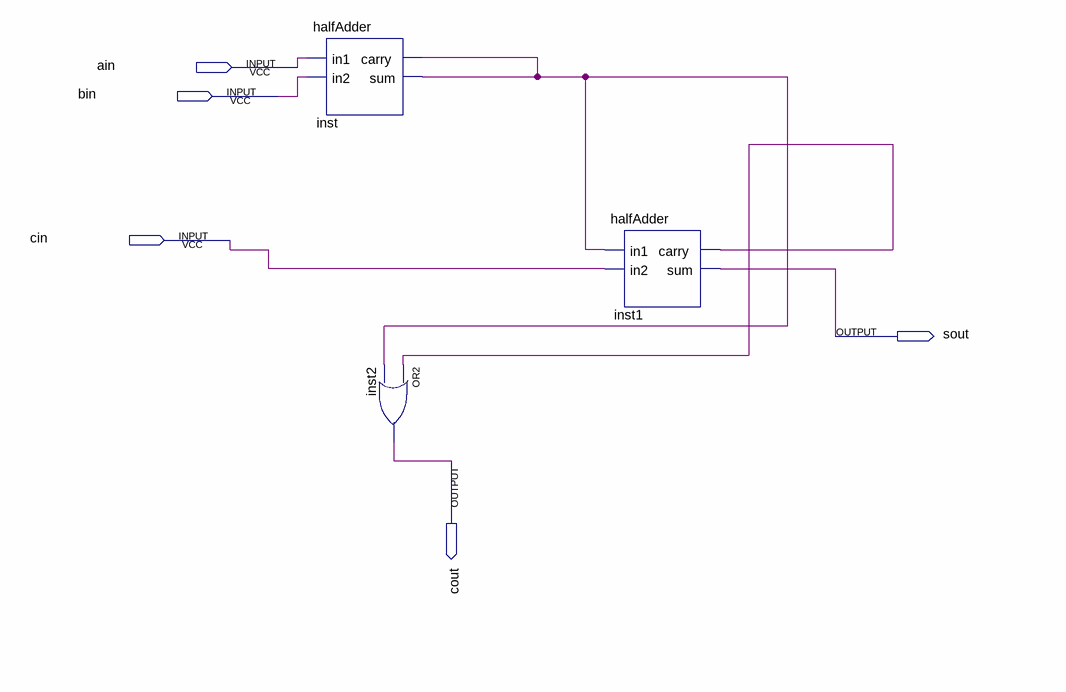
[diagram p0: schematic sheet]
// Quartus schematic fullAdder.bdf as structural Verilog: 3 symbols, 5 pins
module fullAdder (
  input  ain,
  input  bin,
  input  cin,
  output sout,
  output cout
);

  wire inst1_carry, inst_carry;

  halfAdder inst (.in1(ain), .in2(bin), .carry(inst_carry), .sum(inst_carry));
  or inst2 (cout, inst1_carry, inst_carry);
  halfAdder inst1 (.in1(inst_carry), .in2(cin), .carry(inst1_carry), .sum(sout));
endmodule
